# EAGLE schematic PCB Capacitor V1 (EAGLE 9.5.1)
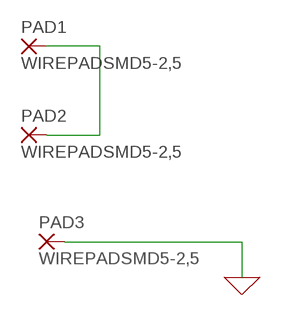
[diagram p0: schematic, sheet 1]

## Parts
PAD1  WIREPADSMD5-2,5  [5-2,5]
PAD2  WIREPADSMD5-2,5  [5-2,5]
PAD3  WIREPADSMD5-2,5  [5-2,5]

## Nets
0: PAD3.1(P) ; supply symbol labelled GND
N$1: PAD1.1(P) PAD2.1(P)

## Library data of the parts
PAD1-PAD3 = wirepad:WIREPAD: Wire PAD connect wire on PCB